# EAGLE schematic ESP32BMS (EAGLE 9.6.2)
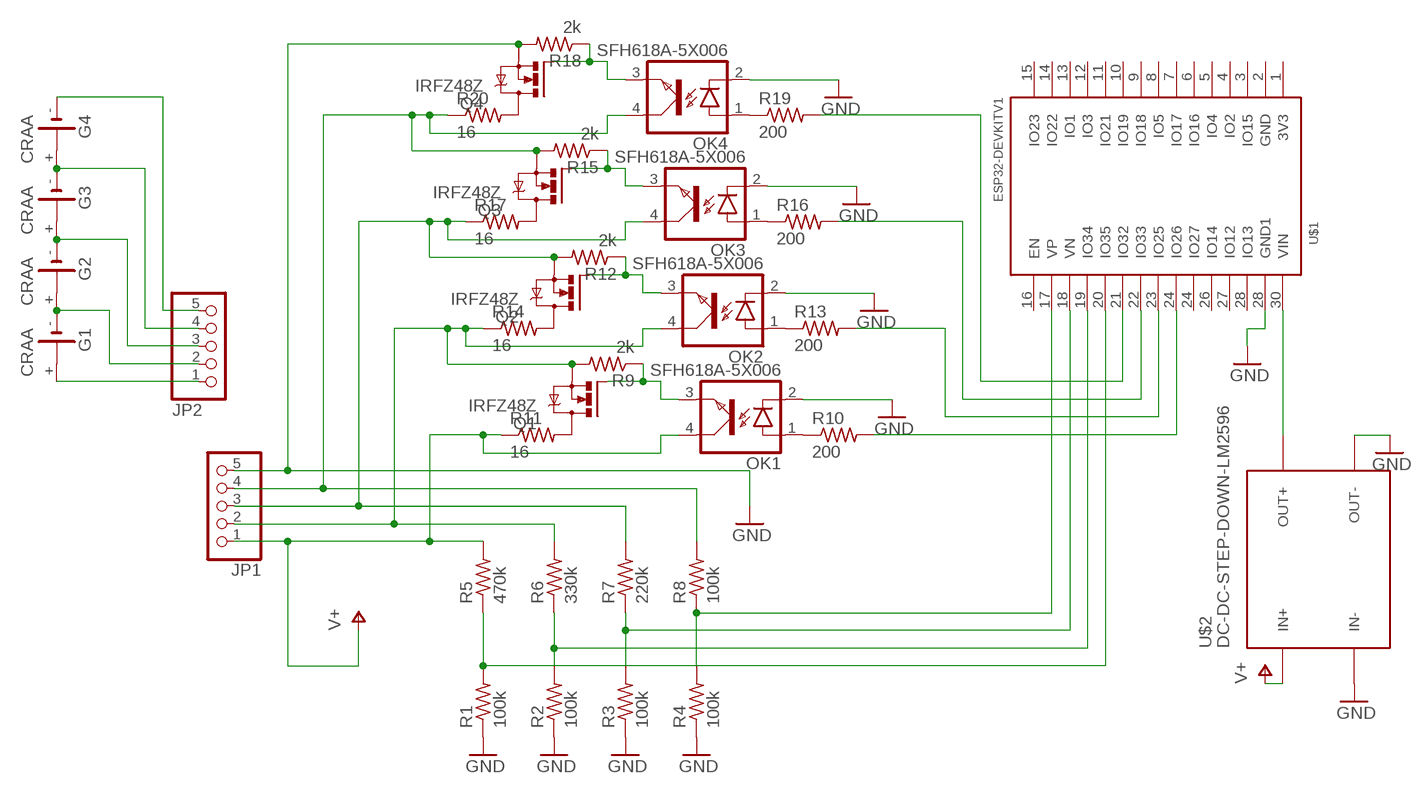
[diagram p0: schematic, sheet 1]

## Parts
G1  CRAA  [CRAA]
G2  CRAA  [CRAA]
G3  CRAA  [CRAA]
G4  CRAA  [CRAA]
JP1  PINHD-1X5  [1X05]
JP2  PINHD-1X5  [1X05]
OK1  SFH618A-5X006  [DIP4-400]
OK2  SFH618A-5X006  [DIP4-400]
OK3  SFH618A-5X006  [DIP4-400]
OK4  SFH618A-5X006  [DIP4-400]
Q1  IRFZ48Z  [TO220BH]
Q2  IRFZ48Z  [TO220BH]
Q3  IRFZ48Z  [TO220BH]
Q4  IRFZ48Z  [TO220BH]
R1  100k  R-US_0204/7  [0204/7]
R2  100k  R-US_0204/7  [0204/7]
R3  100k  R-US_0204/7  [0204/7]
R4  100k  R-US_0204/7  [0204/7]
R5  470k  R-US_0204/7  [0204/7]
R6  330k  R-US_0204/7  [0204/7]
R7  220k  R-US_0204/7  [0204/7]
R8  100k  R-US_0204/7  [0204/7]
R9  2k  R-US_0204/7  [0204/7]
R10  200  R-US_0204/7  [0204/7]
R11  16  R-US_0204/7  [0204/7]
R12  2k  R-US_0204/7  [0204/7]
R13  200  R-US_0204/7  [0204/7]
R14  16  R-US_0204/7  [0204/7]
R15  2k  R-US_0204/7  [0204/7]
R16  200  R-US_0204/7  [0204/7]
R17  16  R-US_0204/7  [0204/7]
R18  2k  R-US_0204/7  [0204/7]
R19  200  R-US_0204/7  [0204/7]
R20  16  R-US_0204/7  [0204/7]
U$1  ESP32DEVKITV1  [ESP32-DEVKITV1]
U$2  DC-DC-STEP-DOWN-LM2596  [DC-DC-STEP-DOWN-LM2596]

## Nets
GND: JP1.5 OK1.2(C) OK2.2(C) OK3.2(C) OK4.2(C) Q4.S R1.1 R2.1 R3.1 R4.1 R18.2 U$1.28(GND1) U$2.IN- U$2.OUT-
N$1: R4.2 R8.1 U$1.17(VP)
N$2: R3.2 R7.1 U$1.18(VN)
N$3: R2.2 R6.1 U$1.19(IO34)
N$4: R1.2 R5.1 U$1.20(IO35)
N$6: JP1.2 OK2.4(COL) Q1.S R6.2 R9.2 R14.1
N$7: JP1.3 OK3.4(COL) Q2.S R7.2 R12.2 R17.1
N$8: JP1.4 OK4.4(COL) Q3.S R8.2 R15.2 R20.1
N$9: OK1.1(A) R10.1
N$10: R19.2 U$1.21(IO32)
N$11: OK2.1(A) R13.1
N$12: R16.2 U$1.22(IO33)
N$13: R13.2 U$1.23(IO25)
N$14: Q1.D R11.2
N$15: OK1.3(EMIT) Q1.G R9.1
N$16: R10.2 U$1.24(IO26)
N$17: Q2.D R14.2
N$18: OK2.3(EMIT) Q2.G R12.1
N$19: U$1.30(VIN) U$2.OUT+
N$20: OK3.1(A) R16.1
N$21: G1.+ G1.- G2.+ G2.- G3.+ G3.- G4.+ JP2.1 JP2.2 JP2.3 JP2.4
N$22: Q3.D R17.2
N$23: OK3.3(EMIT) Q3.G R15.1
N$25: OK4.1(A) R19.1
N$26: G4.- JP2.5
N$27: Q4.D R20.2
N$28: OK4.3(EMIT) Q4.G R18.1
V+: JP1.1 OK1.4(COL) R5.2 R11.1 U$2.IN+
Unconnected: G1.+@1(+) G2.+@1(+) G3.+@1(+) G4.+@1(+) U$1.1(3V3) U$1.2(GND) U$1.3(IO15) U$1.4(IO2) U$1.5(IO4) U$1.6(IO16) U$1.7(IO17) U$1.8(IO5) U$1.9(IO18) U$1.10(IO19) U$1.11(IO21) U$1.12(IO3) U$1.13(IO1) U$1.14(IO22) U$1.15(IO23) U$1.16(EN) U$1.24(IO27) U$1.26(IO14) U$1.27(IO12) U$1.28(IO13)

## Library data of the parts
G1-G4 = battery:CRAA: LI BATTERY Varta
JP1 JP2 = pinhead:PINHD-1X5: PIN HEADER
OK1-OK4 = optocoupler:SFH618?*: Optocoupler, Phototransistor Output, Low Input Current Source: Data sheet <http://www.vishay.com/docs/83673/sfh618.pdf>; OC_FARNELL: unknown; OC_NEWARK: unknown
Q1-Q4 = transistor-power:IRFZ48: N Channel HEXFET® Power MOSFET Logic Level Source: http://www.irf.com/product-info/datasheets/data/irfz48z.pdf
R1-R20 = rcl:R-US_: RESISTOR, American symbol; SPICEPREFIX: R
U$1 = ESP32-DEVKITV1:ESP32DEVKITV1
U$2 = diy-modules:DC-DC-STEP-DOWN-LM2596: DC/DC Step-Down Regulator based on LM2596-ADJ chip LM2596 datasheet available here: http://www.ti.com/lit/ds/symlink/lm2596.pdf Click here to find device on ebay.com <http://www.ebay.com/sch/lm2596+power+regulator>